# Altium schematic sheet DoorCard_ReceiverController.SchDoc
size A4
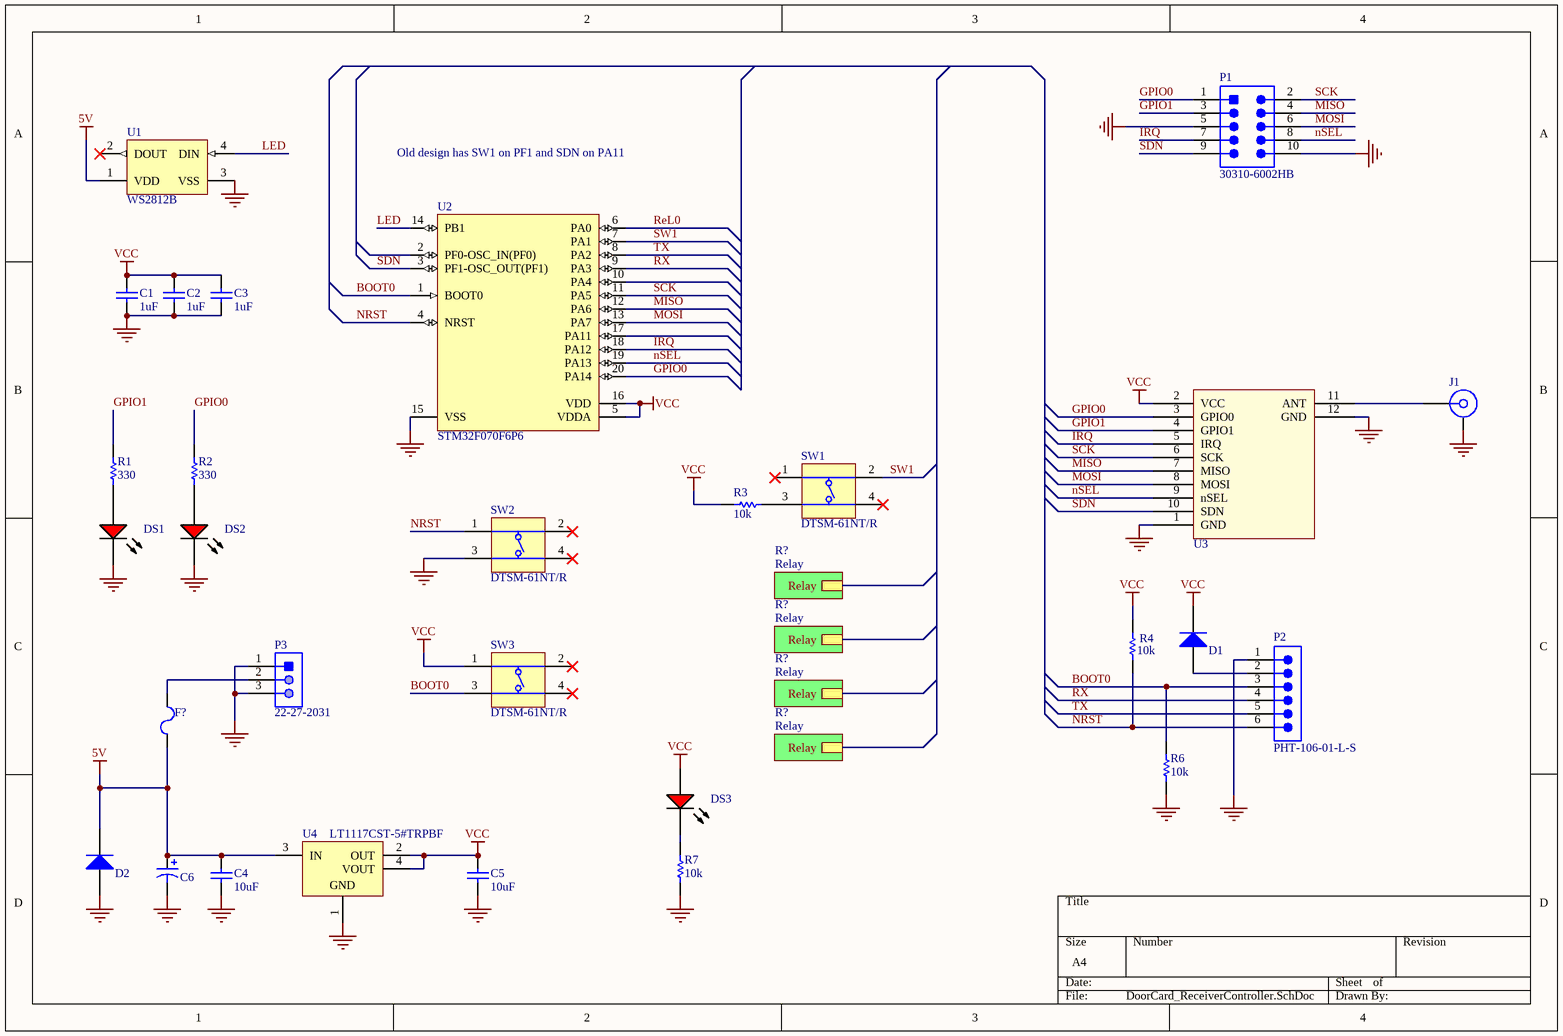
[diagram p0: DoorCard_ReceiverController.SchDoc]

## Parts
C1  1uF  [CAPC0805(2012)100_M]
C2  1uF  [CAPC0805(2012)100_M]
C3  1uF  [CAPC0805(2012)100_M]
C4  10uF  [CAPC1206(3216)130_L]
C5  10uF  [CAPC1206(3216)130_L]
C6  ECA-1HM470  [PNSC-ECA-1HM470]  (value not drawn)
D1  MMSD4148T3G  [ONSC-SOD123-2-425G-04_V]  (value not drawn)
D2  MMSD4148T3G  [ONSC-SOD123-2-425G-04_V]  (value not drawn)
DS1  TLMS1100-GS08  [VISH-TLMX1100_V]  (value not drawn)
DS2  TLMS1100-GS08  [VISH-TLMX1100_V]  (value not drawn)
DS3  TLMS1100-GS08  [VISH-TLMX1100_V]  (value not drawn)
F?  1206L012WR  [LFUS-1206L012WR_V]  (value not drawn)
J1  32K145-400L5  [ROS-32K145-400L5_V]  (value not drawn)
P1  30310-6002HB  [3M-30310-6002HB-10_V]
P2  PHT-106-01-L-S  [SMTC-PHT-106-01-X-S]
P3  22-27-2031  [MOLX-22-27-2031_V]
R1  330  [RESC0805(2012)_L]
R2  330  [RESC0805(2012)_L]
R3  10k  [RESC0805(2012)_L]
R4  10k  [RESC0805(2012)_L]
R6  10k  [RESC0805(2012)_L]
R7  10k  [RESC0805(2012)_L]
SW1  DTSM-61NT/R  [DIPT-DTSM-6_V]
SW2  DTSM-61NT/R  [DIPT-DTSM-6_V]
SW3  DTSM-61NT/R  [DIPT-DTSM-6_V]
U1  WS2812B  [ADAI-WS2812B_V]
U2  STM32F070F6P6  [STM-TSSOP20_M]
U3  Si4463  [E10-433MS]  (value not drawn)
U4  LT1117CST-5#TRPBF  [LT-ST-3-SOT-223_N]

## Sub-sheets
R? = Relay: Relay
R? = Relay: Relay
R? = Relay: Relay
R? = Relay: Relay

## Nets
5V: C4.2 C6.1(+) D2.1(CATHODE) F?.1 U1.1(VDD) U4.3(IN)
GND: C1.1 C2.1 C3.1 C4.1 C5.1 C6.2(-) D2.2(ANODE) DS1.2(K) DS2.2(K) J1.MP P1.5 P1.10 P2.1 P3.1 P3.3 R6.1 R7.1 SW2.3(T3) U1.3(VSS) U2.15(VSS) U3.1(GND) U3.12(GND) U4.1(GND)
VCC: C1.2 C2.2 C3.2 C5.2 D1.1(CATHODE) DS3.1(A) R3.2 R4.2 SW3.1(T1) U2.5(VDDA) U2.16(VDD) U3.2(VCC) U4.2(OUT) U4.4(VOUT)
BOOT0: P2.3 R6.2 SW3.3(T3) U2.1(BOOT0)
GPIO0: P1.1 R2.1 U2.20(PA14) U3.3(GPIO0)
GPIO1: P1.3 R1.1 U3.4(GPIO1)
IRQ: P1.7 U2.18(PA12) U3.5(IRQ)
LED: U1.4(DIN) U2.14(PB1)
MISO: P1.4 U2.12(PA6) U3.7(MISO)
MOSI: P1.6 U2.13(PA7) U3.8(MOSI)
NRST: P2.6 R4.1 SW2.1(T1) U2.4(NRST)
nSEL: P1.8 U2.19(PA13) U3.9(nSEL)
ReL0: U2.6(PA0)
RX: P2.4 U2.9(PA3)
SCK: P1.2 U2.11(PA5) U3.6(SCK)
SDN: P1.9 U2.3(PF1-OSC_OUT(PF1)) U3.10(SDN)
SW1: SW1.2(T2) U2.7(PA1)
TX: P2.5 U2.8(PA2)
NetD1_2: D1.2(ANODE) P2.2
NetDS1_1: DS1.1(A) R1.2
NetDS2_1: DS2.1(A) R2.2
NetDS3_2: DS3.2(K) R7.2
NetF?_2: F?.2 P3.2
NetJ1_1: J1.1 U3.11(ANT)
NetR3_1: R3.1 SW1.3(T3)

Not connected (* = marked no-connect by the designer): SW1 1(T1)* 4(T3)*; SW2 2(T2)* 4(T3)*; SW3 2(T2)* 4(T3)*; U1 2(DOUT)*; U2 2(PF0-OSC_IN(PF0)) 10(PA4) 17(PA11)

## Notes on the sheet
- Old design has SW1 on PF1 and SDN on PA11

## Library data of the parts
C1-C3 = CMP-1036-04754-1: CAP 1uF 25V ±10% 0805 (2012 Metric) Thickness 1mm SMD; Case-EIA: 0805; Case-Metric: 2012; Tolerance: Â±10%; Max Thickness: 1 mm; Value: 1uF; Rated Voltage: 25 V; Technology: SMT
C4 C5 = CMP-1037-04970-1: Case-Metric: 3216; Rated Voltage: 10 V; Tolerance: -20% to +80%; Case-EIA: 1206; Value: 10uF; Technology: SMT; Max Thickness: 1.3 mm
C6 = CMP-1665-00013-1: CAP ALUM 47UF 50V 20% RADIAL; PartNumber: ECA-1HM470; PackageReference: ECA-1HM470; ComponentLink1Description: Datasheet; ComponentLink1URL: http://industrial.panasonic.com/cdbs/www-data/pdf/RDF0000/ABA0000C1047.pdf
D1 D2 = CMP-0895-00002-1: Switching Diode, 100 V, 200 mA, -55 to 150 degC, 2-Pin SOD123 (425), RoHS, Tape and Reel; Manufacturer: ON Semiconductor; CD (Max): 4 pF; IR @ VR: 75 V (Max)=50 uA; PD (Max): 425 mW; VF (Max): 1 A; Trr (Max): 4 ns; VBR (Min): 100 V; ComponentLink1URL: http://www.onsemi.com/; ComponentLink1Description: Manufacturer URL; PackageReference: SOD123-2-425G-04; PackageDescription: 2-Pin SOD123, Body 2.69 x 1.6 mm, Height 1.35 mm; ComponentLink2Description: Datasheet; Mounting Technology: Surface Mount; RoHS: TRUE; PartNumber: MMSD4148T3G; PackageVersion: Rev. 04G; DatasheetVersion: Rev. 11; Temperature Range: -55 to 150 degC; ComponentLink3Description: Package Specification; Packing: Tape and Reel; ComponentLink3URL: http://www.onsemi.com/pub_link/Collateral/425-04.PDF; ComponentLink2URL: http://www.onsemi.com/pub_link/Collateral/MMSD4148T1-D.PDF
DS1-DS3 = CMP-1666-00027-1: LED, RED, 2.1 V, -40 to 100 degC, 2-Pin SMD (0603), RoHS, Tape and Reel; Type (Capacitors): C0G; Resistance: 100000000000 Ohm; Capacitance: 12 pF; Voltage Rating: 50 V; Tolerance: 5%; Min Operating Temperature: -55degC; REACH SVHC: No SVHC; ComponentLink2Description: Datasheet; ComponentLink1URL: http://www.vishay.com/; Width: 0.8 mm; Package Quantity: 4000; PackageReference: TLMX1100; ComponentLink2URL: http://www.vishay.com/docs/83173/tlmb1100.pdf; Case/Package: 0603; Case Code (Metric): 1608; Packaging: Tape and Reel; Pins: 2; ComponentLink1Description: Manufacturer URL; Max Operating Temperature: 125degC; Height: 0.8 mm; Length: 1.6 mm; Mount: Surface Mount; PackageDescription: 2-Pin Surface Mount Device, Body 1.6 x 0.8 mm; DatasheetVersion: Rev. 2.7, 03/2016; Case Code (Imperial): 0603; Voltage Rating (DC): 50 V; RoHSCompliant: True; Radiation Hardening: No
F? = CMP-2000-05470-1: POLY-FUSE(R) Resettable PTC, 30 V, -40 to 85 degC, 2-Pin SMD, RoHS, Tape and Reel; Manufacturer: Littelfuse; Hold Current [Ih]: 0.125A; Working Voltage-Max: 30V; Trip Current: 0.29A; Operating Temp Range: -40to+85°C; Package Reference: 1206; Package Description: 2-Pin Surface Mount Device, Body 3.2 x 1.65 mm; Mounting Technology: SurfaceMount; Manufacturer URL: http://www.littelfuse.com/; Datasheet URL: https://datasheet.ciiva.com/26787/1206l012wr-26787215.pdf; Size: 1206; Datasheet Version: 04/2012
J1 = CMP-0751-00004-2: SMA Right Angle Jack, Edge Mount, Up to 18 GHz, -55 to 155 degC; Manufacturer: Rosenberger; Desgin Note 2: For more information about DRC setting, please look at following webpage, http://techdocs.altium.com/display/SCRT/Design+Rule+for+Edge-Mount+Connectors; Design Note 1: Footprint in library is a generic example - only application specific footprint delivers High Performance; ComponentLink5Description: Webshop / RFQ; ComponentLink5URL: http://www.rosenberger.com/en/contact/sales/; ComponentLink3URL: http://rosenberger.de/ok/images/documents/db/32K145-400L5.pdf; DatasheetVersion: b00; ComponentLink2URL: http://rosenberger.de/ok/images/documents/db/32K145-400L5.pdf; ComponentLink4Description: Series Overview / Design Note; ComponentLink1Description: Manufacturer URL; PackageReference: 32K145-400L5; ComponentLink2Description: Datasheet; PartNumber: 32K145-400L5; PackageVersion: b00; PackageDescription: SMA Right Angle Jack, Edge Mount, 14.25 x 9.5 x 4.46 mm; ComponentLink3Description: Package Specification; ComponentLink1URL: http://www.rosenberger.de; ComponentLink4URL: http://rosenberger.de/ok/images/documents/spez/32.pdf; Mounting Technology: Surface Mount
P1 = CMP-2000-05031-1: Male Header, Pitch 2.54 mm, 2 x 5 Position, Height 9.3 mm, Tail Length 2.79 mm, -55 to 105 degC, RoHS, Bulk; Manufacturer: 3M; Current Rating: 1A; Brand: 3MElectronicSolutionsDivision; Mounting Angle: Straight; Number of Positions: 10Position; Mating Post Length: 5.99mm; Pitch: 2.54mm; Manufacturer URL: http://www.3m.com/; Factory Pack Quantity: 1000; Mounting Style: StraightPin; Number of Rows: 2Row; Termination Post Length: 2.79mm; Contact Gender: Pin(Male); Contact Material: Brass; Termination Style: ThroughHole; Product: Headers; Packaging: Tray; Product Category: Headers&WireHousings; Type: Shrouded; Datasheet URL: http://datasheet.octopart.com/30310-6002HB-3M-datasheet-11537585.pdf; Datasheet Version: Apr-12; Contact Plating: Gold; Row Spacing: 2.54mm; Housing Material: Polyester; Series: 303; RoHS: Details
P2 = CMP-1024-00187-1: Press Fit Header, Through-hole, Vertical, -55 to 125 degC, 2.54 mm Pitch, 6-Pin, Male, RoHS; Manufacturer: Samtec; Pitch: 2.54 mm; PackageReference: PHT-106-01-X-S; PackageDescription: .100 Press Fit Socket Assembly; ComponentLink3URL: http://www.samtec.com/documents/webfiles/cpdf/PHT-1XX-XX-X-X-XXX-MKT.pdf; PackageVersion: J, 9/2009; ComponentLink3Description: Package Specification; PartNumber: PHT-106-01-L-S; ComponentLink1Description: Manufacturer URL; Orientation: Vertical; Mounting Technology: Through-hole; ComponentLink1URL: http://www.samtec.com; ComponentLink2URL: http://www.samtec.com/documents/webfiles/pdf/pht.pdf; Temperature Range: -55 to 125 degC; RoHS: True; DatasheetVersion: F-214; ComponentLink2Description: Datasheet
P3 = CMP-2000-05538-1: Male Header, Pitch 2.54 mm, 1 x 3 Position, Height 11.7 mm, Tail Length 3.56 mm, -40 to 80 degC, RoHS, Bulk; Manufacturer: Molex; Voltage rating: 250V; Current rating: 4A; Package Reference: 22-27-2031; Housing material: Nylon(UL94V-0); Operating temperature: 0°Cto+75°C; Package Description: Male Header, Pitch 2.54 mm, 1 x 3 Position, Height 11.7 mm, Tail Length 3.56 mm; Package URL: http://www.molex.com/pdm_docs/sd/022272031_sd.pdf; Datasheet Version: 06/2016; Manufacturer URL: http://www.molex.com/; Mounting Technology: ThroughHole; Datasheet URL: http://www.molex.com/webdocs/datasheets/pdf/en-us/0022272031_PCB_HEADERS.pdf; Contact material: Tinplatedbrass
R1-R4 R6 R7 = CMP-1013-00624-1: 10K2 0.125W 1% 0805 (2012 Metric)  SMD; Case-Metric: 2012; Case-EIA: 0805; Value: 10200.00 Ohm; Technology: SMT; Tolerance: 1 %; Power: 0.125 W
SW1-SW3 = CMP-0306-00001-1: Switch, SPNO Push Button SMD; Manufacturer: Diptronics; Packing Type: Tape&Reel; Mechanical Life: 200,000 cycles; ComponentLink2URL: http://www.dip.com.tw/Products_tact.htm; ComponentLink1URL: http://www.dip.com.tw/; ComponentLink3URL: http://www.dip.com.tw/PDF/pro_tact/DTSM_G_-6_2_-V.pdf; PackageDescription: Switch, Through-Hole, 4 Leads, Body 8.5x8.5mm, Row Spacing 9.0mm, Pitch 4.5mm; ComponentLink2Description: Datasheet; ComponentLink3Description: Package Specification; ComponentLink1Description: Manufacturer URL; PackageReference: DTSM-6; PartNumber: DTSM-61NT/R; Mounting Technology: Through Hole
U1 = CMP-1740-00005-1: Intelligent Control LED Integrated Light Source, 3.5 to 5.3 V, -25 to 80 degC, 4-Pin SMD, RoHS, Bulk; Case\Package: Radial; Shielding: Unshielded; Current Rating: 240 mA; Tolerance: 10%; Mount: Through Hole; Max Operating Temperature: 125 degC; Radiation Hardening: No; Length: 12.2 mm; Min Operating Temperature: -55 degC; ComponentLink1URL: https://www.adafruit.com/; Packaging: Bulk; Lead Pitch: 5 mm; RoHSCompliant: true; Pins: 2; Package Quantity: 200; ComponentLink2URL: https://cdn-shop.adafruit.com/datasheets/WS2812B.pdf; ComponentLink2Description: Datasheet; PackageDescription: 4-Pin Surface Mount Device, Body 5 x 5 mm, Pitch 3.3 mm; PackageReference: WS2812B; Height: 12.2 mm; REACH SVHC: No SVHC; ComponentLink1Description: Manufacturer URL; DatasheetVersion: May-13
U2 = CMP-0304-00145-2: ARM Cortex-M0 32-bit MCU, 32 KB Flash, 6 KB Internal RAM, 15 I/Os, 20-Pin TSSOP, -40 to 85 degC, Tray; Manufacturer: STMicroelectronics; FLASH Size (Prog) (kB): 32; Internal RAM Size (kB): 6; Operating Frequency(F) (Processor speed) (MHz): 48; Supply Voltage(Vcc) min (V): 2.4; I/Os (High Current): 15; ComponentLink2URL: http://www.st.com/st-web-ui/static/active/en/resource/technical/document/datasheet/DM00141386.pdf; ComponentLink2Description: Datasheet; Packing: Tray; DatasheetVersion: Rev. 3; PartNumber: STM32F070F6P6; Core: ARM Cortex-M0; Package Reference: TSSOP20; Package Description: 20-Pin Thin Shrink Small Outline Package, Body 6.5 x 4.4 mm, Pitch 0.65 mm; ComponentLink1Description: Manufacturer URL; ComponentLink1URL: http://www.st.com/; Mounting Technology: Surface Mount
U3 = Component_1: E10-433MS
U4 = CMP-0476-01803-1: 0.8 A Low Dropout Positive Regulator, 2.45 to 15 V Vin, 5 V Vout, 3-pin SOT223 (ST-3), 0 to 125 degC, Pb-Free, Tape and Reel; Manufacturer: Linear Technology; Discrete Pass Element: no; Iout(mA): 800; Number of Outputs: 1; Dropout Voltage(V): 1.1; Isupply(mA): 5; Vin Min(V): 2.45; Output Voltage: 5 V; Vin Max(V): 15; PSRR(dB): 75; PartNumber: LT1117CST-5#TRPBF; ComponentLink3Description: Package Specification; ComponentLink3URL: http://cds.linear.com/docs/en/packaging/SOT_3_05-08-1630.pdf; DatasheetVersion: Rev. D; Mounting Technology: Surface Mount; ComponentLink2URL: http://cds.linear.com/docs/en/datasheet/1117fd.pdf; ComponentLink2Description: Datasheet; PackageVersion: Jun-10; ComponentLink1Description: Manufacturer URL; PackageDescription: 3-Pin Plastic SOT-223, 3.505 x 6.505 mm Body, Pitch 2.3 mm; PackageReference: ST-3; ComponentLink1URL: http://www.linear.com/; RoHS: TRUE; Packing: Tape and Reel